# EAGLE design RH039.2 (EAGLE 7.1.0)
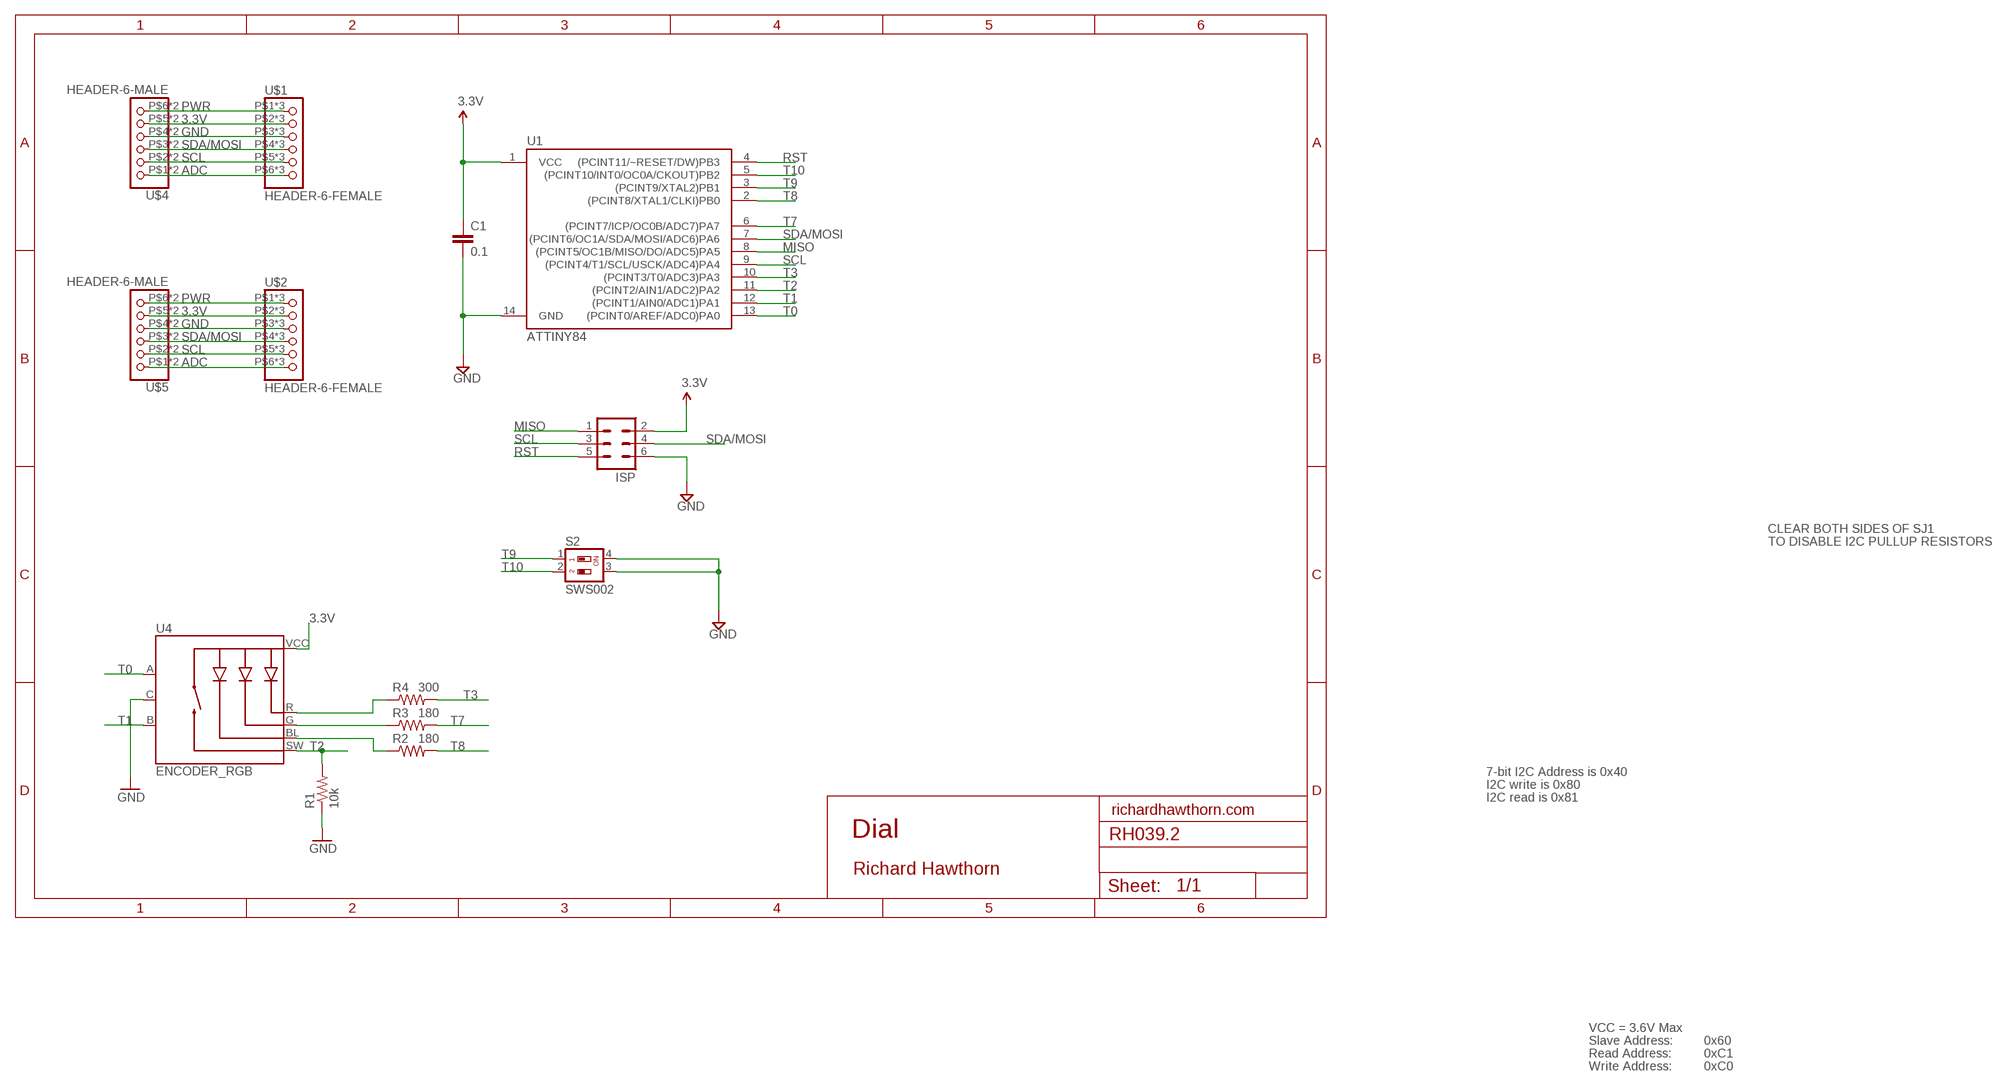
[diagram p0: schematic, sheet 1]

## Parts
C1  0.1  CAP0603-CAP  [0603-CAP]
ISP  MA03-2  [MA03-2]
R1  10k  RESISTOR0402-RES  [0402-RES]
R2  180  RESISTOR0402-RES  [0402-RES]
R3  180  RESISTOR0402-RES  [0402-RES]
R4  300  RESISTOR0402-RES  [0402-RES]
S2  SWS002  [SMS-002]
U1  ATTINY84  [SO14]
U4  ENCODER_RGB  [ENCODER_LED_RGB]
U$1  HEADER-6-FEMALE  [2MMHEADER6]
U$2  HEADER-6-FEMALE  [2MMHEADER6]
U$4  HEADER-6-MALE  [2MMHEADERPIN6]
U$5  HEADER-6-MALE  [2MMHEADERPIN6]

## Nets
3.3V: C1.1 ISP.2 U1.1(VCC) U4.VCC U$1.P$2 U$1.P$10 U$1.P$18 U$2.P$2 U$2.P$10 U$2.P$18 U$4.P$5 U$4.P$13 U$5.P$5 U$5.P$13
ADC: U$1.P$6 U$1.P$14 U$1.P$22 U$2.P$6 U$2.P$14 U$2.P$22 U$4.P$1 U$4.P$9 U$5.P$1 U$5.P$9
GND [power]: C1.2 ISP.6 R1.1 S2.3 S2.4 U1.14(GND) U4.C U$1.P$3 U$1.P$11 U$1.P$19 U$2.P$3 U$2.P$11 U$2.P$19 U$4.P$4 U$4.P$12 U$5.P$4 U$5.P$12
LED-B: R2.1 U4.BL
LED-G: R3.1 U4.G
LED-R: R4.1 U4.R
MISO: ISP.1 U1.8((PCINT5/OC1B/MISO/DO/ADC5)PA5)
PWR [power]: U$1.P$1 U$1.P$9 U$1.P$17 U$2.P$1 U$2.P$9 U$2.P$17 U$4.P$6 U$4.P$14 U$5.P$6 U$5.P$14
RST: ISP.5 U1.4((PCINT11/~RESET/DW)PB3)
SCL: ISP.3 U1.9((PCINT4/T1/SCL/USCK/ADC4)PA4) U$1.P$5 U$1.P$13 U$1.P$21 U$2.P$5 U$2.P$13 U$2.P$21 U$4.P$2 U$4.P$10 U$5.P$2 U$5.P$10
SDA/MOSI: ISP.4 U1.7((PCINT6/OC1A/SDA/MOSI/ADC6)PA6) U$1.P$4 U$1.P$12 U$1.P$20 U$2.P$4 U$2.P$12 U$2.P$20 U$4.P$3 U$4.P$11 U$5.P$3 U$5.P$11
T0: U1.13((PCINT0/AREF/ADC0)PA0) U4.A
T1: U1.12((PCINT1/AIN0/ADC1)PA1) U4.B
T2: R1.2 U1.11((PCINT2/AIN1/ADC2)PA2) U4.SW
T3: R4.2 U1.10((PCINT3/T0/ADC3)PA3)
T7: R3.2 U1.6((PCINT7/ICP/OC0B/ADC7)PA7)
T8: R2.2 U1.2((PCINT8/XTAL1/CLKI)PB0)
T9: S2.1 U1.3((PCINT9/XTAL2)PB1)
T10: S2.2 U1.5((PCINT10/INT0/OC0A/CKOUT)PB2)

## Notes on the sheet
- CLEAR BOTH SIDES OF SJ1
- TO DISABLE I2C PULLUP RESISTORS
- 7-bit I2C Address is 0x40
- I2C write is 0x80
- I2C read is 0x81
- richardhawthorn.com
- Dial
- Richard Hawthorn
- VCC = 3.6V Max
- Slave Address: | 0x60
- Read Address: | 0xC1
- Write Address: | 0xC0

## Library data of the parts
C1 = LowPowerLab:CAP: Capacitor Standard 0603 ceramic capacitor, and 0.1" leaded capacitor.
ISP = Richards:MA03-2: PIN HEADER; OC_FARNELL: unknown; OC_NEWARK: unknown
R1-R4 = SparkFun:RESISTOR: Resistor Basic schematic elements and footprints for 0603, 1206, and PTH resistors.
S2 = smd-special:SWS002: SMD Dip Switch 2 pol.
U1 = SparkFun-DigitalIC:ATTINY84: Atmel 14-pin 2/4/8kB flash uC
U4 = SparkFun:ENCODER_RGB: Illuminated Rotary Encoder w/ RGB LED and select switch EC12PLRGBSDVBF-D: http://top-up.so-buy.com/front/bin/ptdetail.phtml?Part=EC12PLRGBSDVBF-D
U$1 U$2 = Richards:HEADER-6-FEMALE
U$4 U$5 = Richards:HEADER-6-MALE

## Net classes
1 power: width 0.381 mm, clearance 0.254 mm

## Board
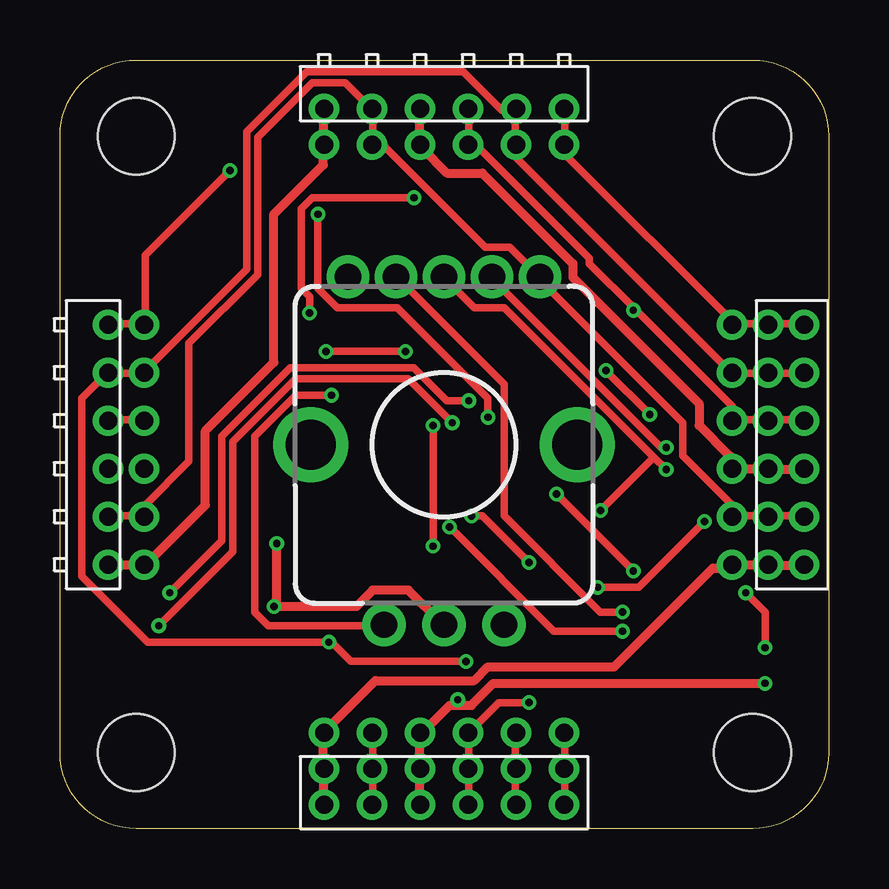
[diagram p1: board, top side]
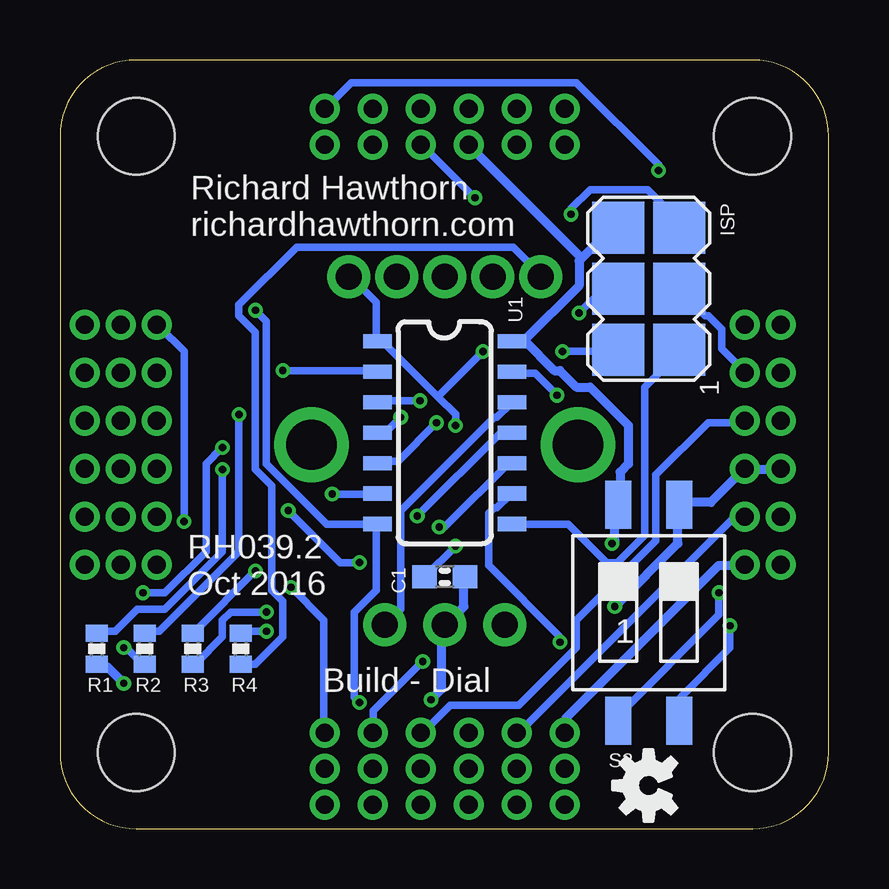
[diagram p2: board, bottom side, seen from below]

Size 32.03 x 32.03 mm. Coordinates in mm from the lower left corner, seen from the top.
Outline: 0,3.17 0,28.86 arc-90 3.17,32.03 28.86,32.03 arc-90 32.03,28.86 32.03,3.17 arc-90 28.86,0 3.17,0 arc-90 0,3.17
Copper layers (1*16): Top 0.035mm / dielectric 1.5mm / Bottom 0.035mm
Design rules "ITEADstudio_DRC *": minimum track width 12mil, minimum drill 12mil, track to track 6mil, track to pad 6mil, pad to pad 6mil, via to via 6mil, smd to smd 0mil, copper to edge 10mil, drill to drill 10mil, minimum pad ring 10mil, minimum via ring 6mil, stop-mask expansion 2mil, vias tented up to drill 100mil, thermal gap 15mil
Holes 3.2 mm at 3.17,3.17 28.86,3.17 3.17,28.86 28.86,28.86
tRestrict: area 0,0 to 5.7,5.7; area 26.3,0 to 32,5.7; area 26.3,26.3 to 32,32; area 0,26.3 to 5.7,32
bRestrict: area 0,26.3 to 5.7,32; area 26.3,26.3 to 32,32; area 26.3,0 to 32,5.7; area 0,0 to 5.7,5.7

### Footprints (pad centres in the part's own frame; a part is rotated, then mirrored left to right if it is on the bottom)
0603-CAP = smd 1.016 x 0.965: 1 -0.85,0; 2 0.85,0
MA03-2 = smd 2.159 x 2.159: 1 -2.54,-1.27; 2 -2.54,1.27; 3 0,-1.27; 4 0,1.27; 5 2.54,-1.27; 6 2.54,1.27
0402-RES = smd 0.7 x 0.9: 1 -0.65,0; 2 0.65,0
SMS-002 = smd 1.092 x 2.007: 1 -1.27,-4.496; 2 1.27,-4.496; 3 1.27,4.496; 4 -1.27,4.496
SO14 = smd 0.6 x 1.2: 1 -3.81,-2.8; 2 -2.54,-2.8; 3 -1.27,-2.8; 4 0,-2.8; 5 1.27,-2.8; 6 2.54,-2.8; 7 3.81,-2.8; 8 3.81,2.8; 9 2.54,2.8; 10 1.27,2.8; 11 0,2.8; 12 -1.27,2.8; 13 -2.54,2.8; 14 -3.81,2.8
ENCODER_LED_RGB = drill 1.1 pad 1.8: A -2.5,-7.5; B 2.5,-7.5; C 0,-7.5 | drill 1.1 pad 1.778: BL 2,7; G -2,7; R -4,7; SW 0,7; VCC 4,7 | drill 2.1: P$1 -5.55,0; P$2 5.55,0
2MMHEADER6 = drill 0.75: P$1 1,5; P$2 1,3; P$3 1,1; P$4 1,-1; P$5 1,-3; P$6 1,-5; P$9 -0.5,5; P$10 -0.5,3; P$11 -0.5,1; P$12 -0.5,-1; P$13 -0.5,-3; P$14 -0.5,-5; P$17 -2,5; P$18 -2,3; P$19 -2,1; P$20 -2,-1; P$21 -2,-3; P$22 -2,-5
2MMHEADERPIN6 = drill 0.75: P$1 1,5; P$2 1,3; P$3 1,1; P$4 1,-1; P$5 1,-3; P$6 1,-5; P$9 -0.5,5; P$10 -0.5,3; P$11 -0.5,1; P$12 -0.5,-1; P$13 -0.5,-3; P$14 -0.5,-5

### Placement (x,y rotation side)
C1  16,10.5 0 bottom
ISP  7.5,22.5 90 bottom
R1  30.5,7.5 90 bottom
R2  28.5,7.5 90 bottom
R3  26.5,7.5 90 bottom
R4  24.5,7.5 90 bottom
S2  7.5,9 0 bottom
U1  16,16.5 270 bottom
U4  16,16 0 top
U$1  16,3 90 top
U$2  29,16 180 top
U$3  [OSHW-LOGO-S]  7.5,1.8 90 bottom
U$4  16,29.5 270 top
U$5  2.5,16 0 top

### Tracks (layer width: path | path; a pad name or v marks a point on that pad's centre or on a via)
3.3V  (via drill 0.3)
  Top 0.305: U$5.P$13 2.06,13.03 3.43,13.03 U$5.P$5 3.54,13.14 3.54,13.49 5.37,15.32 5.37,20.23 8.23,23.09 8.23,28.8 10.52,31.09 11.89,31.09 12.92,30.06 U$4.P$13 13.03,29.95 13.03,28.57 U$4.P$5 13.14,28.46 13.49,28.46 17.72,24.23 18.75,24.23 19.89,23.09 U4.VCC 20,22.86 25.95,16.92 25.95,15.54 28,13.49 28,13.14 U$2.P$2 28,13.03 29.49,13.03 U$2.P$10 29.6,13.03 30.98,13.03 U$2.P$18 | U$1.P$18 13.03,1.03 13.03,2.4 U$1.P$10 13.03,2.63 13.03,3.89 U$1.P$2 | v15.54,16.8 v15.54,11.77 | v14.4,19.89 v11.09,19.89
  Bottom 0.305: U$5.P$5 3.54,12.92 4,12.92 12.92,4 U$1.P$2 | v15.54,11.77 16.8,10.52 C1.1 | v15.54,16.8 15.54,17.26 16.29,18 | 16.29,18 18.52,20.23 18.75,20.23 U1.1 18.86,20.34 18.86,21.95 19.89,22.97 U4.VCC | v11.09,19.89 8.8,19.89 ISP.2 | 16.29,18 v14.4,19.89
ADC  (via drill 0.3)
  Top 0.305: U$5.P$9 2.06,21.03 3.43,21.03 U$5.P$1 3.54,21.14 3.54,23.89 v7.09,27.43 | U$4.P$9 21.03,29.95 21.03,28.57 U$4.P$1 21.14,28.46 21.14,28 28,21.14 U$2.P$6 28,21.03 29.49,21.03 U$2.P$14 29.6,21.03 30.98,21.03 U$2.P$22 | U$1.P$22 21.03,1.03 21.03,2.4 U$1.P$14 21.03,2.63 21.03,3.89 U$1.P$6 | v22.4,10.06 24.12,10.06 v26.86,12.8
  Bottom 0.305: v7.09,27.43 7.09,27.66 10.52,31.09 19.89,31.09 20.92,30.06 U$4.P$9 | v22.4,10.06 21.03,8.69 21.03,4 U$1.P$6 | v26.86,12.8 26.86,19.89 27.89,20.92 U$2.P$6
GND  (via drill 0.3)
  Top 0.381: U$2.P$19 30.98,14.97 29.6,14.97 U$2.P$11 29.49,14.97 28,14.97 U$2.P$3 27.89,15.09 27.89,15.54 26.63,16.8 26.63,17.72 21.37,22.97 21.37,23.55 17.6,27.32 16.12,27.32 15.09,28.35 U$4.P$4 14.97,28.57 14.97,29.95 U$4.P$12 | U$1.P$19 14.97,1.03 14.97,2.4 U$1.P$11 14.97,2.63 14.97,3.89 U$1.P$3 15.09,4 16.23,5.14 16.57,5.14 | v29.38,6.06 18.06,6.06 17.14,5.14 16.57,5.14 | v16.57,5.37 16.57,5.14 | U4.C 15.89,8.57 14.52,9.94 13.03,9.94 12.34,9.26 v8.91,9.26 9.03,9.37 v9.03,11.89
  Bottom 0.381: 12.69,20.34 13.14,20.34 U1.14 | 12.69,20.34 10.4,22.63 10.4,23.66 10.29,23.77 | 10.29,23.77 9.03,25.03 8.8,25.03 ISP.6 | 12.69,20.34 11.43,19.09 11.2,19.09 10.52,18.4 9.94,18.4 8.34,16.8 8.34,15.2 8.69,14.86 8.69,13.6 S2.4 8.91,13.37 8.91,12 v9.03,11.89 | 10.29,23.77 14.97,28.46 U$4.P$4 | U$5.P$12 2.06,14.97 3.31,14.97 U$5.P$4 3.54,14.97 4.92,13.6 6.17,13.6 S2.3 6.29,13.37 6.29,11.89 v8.91,9.26 | C1.2 15.2,10.4 15.2,9.26 15.89,8.57 U4.C 16.12,8.34 16.12,5.83 v16.57,5.37 | v29.38,6.06 30.06,6.74 30.4,6.74 R1.1
LED-B  (via drill 0.3)
  Top 0.305: v29.38,7.54 29.38,9.03 v28.57,9.83 | v25.26,15.89 25.03,15.89 17.95,22.97 U4.BL
  Bottom 0.305: v29.38,7.54 29.26,7.54 28.57,6.86 R2.1 | v28.57,9.83 27.66,9.83 25.95,11.54 25.95,15.2 v25.26,15.89
LED-G  (via drill 0.3)
  Top 0.305: v23.43,9.03 22.52,9.03 18.52,13.03 18.52,18.52 14.06,22.97 U4.G
  Bottom 0.305: v23.43,9.03 24.92,9.03 25.26,8.69 25.26,8 26.4,6.86 R3.1
LED-R
  Bottom 0.305: R4.1 24.46,6.86 23.89,6.86 22.75,8 22.75,9.49 23.2,9.94 23.2,14.29 23.89,14.97 23.89,20.69 24.57,21.37 24.57,21.83 22.17,24.23 13.14,24.23 12,23.09 U4.R
MISO
  Bottom 0.305: U1.8 13.14,12.69 10.86,12.69 9.26,11.09 8.8,11.09 7.66,12.23 7.66,18.4 6.17,19.89 ISP.1
PWR
  Top 0.381: U$2.P$17 30.98,10.97 29.6,10.97 U$2.P$9 29.49,10.97 28,10.97 U$2.P$1 27.89,10.86 27.2,10.86 23.09,6.74 17.83,6.74 17.26,6.17 13.14,6.17 11.09,4.12 U$1.P$1 10.97,3.89 10.97,2.63 U$1.P$9 10.97,2.4 10.97,1.03 U$1.P$17 | U$4.P$14 10.97,29.95 10.97,28.57 U$4.P$6 10.97,28.35 10.97,27.66 8.91,25.6 8.91,19.43 6.06,16.57 6.06,13.49 3.66,11.09 U$5.P$6 3.43,10.97 2.06,10.97 U$5.P$14
  Bottom 0.381: U$5.P$6 3.54,10.97 4.57,10.97 10.97,4.57 10.97,4 U$1.P$1
RST  (via drill 0.3)
  Top 0.305: v17.83,17.14 17.83,17.95 14.06,21.72 11.54,21.72 10.74,22.52 v10.74,25.6
  Bottom 0.305: v17.83,17.14 18.4,16.57 18.75,16.57 U1.4 | v10.74,25.6 10.74,25.83 9.94,26.63 7.54,26.63 6.29,25.38 6.29,25.15 ISP.5
SCL  (via drill 0.3)
  Top 0.305: U$2.P$21 30.98,18.97 29.6,18.97 U$2.P$13 29.49,18.97 28,18.97 U$2.P$5 27.89,19.09 18.97,28 18.97,28.35 U$4.P$2 18.97,28.57 18.97,29.95 U$4.P$10 18.86,29.95 18.4,29.95 16.8,31.55 10.29,31.55 7.77,29.03 7.77,23.32 3.54,19.09 U$5.P$2 3.43,18.97 2.06,18.97 U$5.P$10 1.94,18.97 0.91,17.95 0.91,10.52 3.66,7.77 v11.2,7.77 11.32,7.77 12.12,6.97 v16.92,6.97 | U$1.P$21 18.97,1.03 18.97,2.4 U$1.P$13 18.97,2.63 18.97,3.89 U$1.P$5
  Bottom 0.305: ISP.3 6.17,22.4 5.14,21.37 5.03,21.37 4.46,20.8 4.46,20 3.54,19.09 U$5.P$2 | v11.2,7.77 11.2,8 14.17,10.97 14.17,13.14 13.95,13.37 13.83,13.37 13.26,13.95 U1.9 | v16.92,6.97 18.97,4.92 18.97,4 U$1.P$5
SDA/MOSI  (via drill 0.3)
  Top 0.305: U$5.P$11 2.06,17.03 3.43,17.03 U$5.P$3 | U$1.P$20 17.03,1.03 17.03,2.4 U$1.P$12 17.03,2.63 17.03,3.89 U$1.P$4 17.03,4 18.29,5.26 v19.55,5.26 | U$2.P$20 30.98,17.03 29.6,17.03 U$2.P$12 29.49,17.03 28,17.03 U$2.P$4 28,17.14 28,17.6 23.95,21.66 | v10.4,21.49 10.4,22.17 10.06,22.52 10.06,25.83 10.52,26.29 v14.74,26.29 | U$4.P$11 17.03,29.95 17.03,28.57 U$4.P$3 17.14,28.69 22.06,23.77 22.06,23.55 23.95,21.66 | v23.89,21.6 23.95,21.66
  Bottom 0.305: v19.55,5.26 19.77,5.49 19.77,9.03 18.86,9.94 18.86,12.69 U1.7 18.97,12.69 20.92,12.69 23.43,15.2 23.43,21.14 v23.89,21.6 | U$5.P$3 3.54,16.92 5.03,16.92 7.2,14.74 7.2,12 10.52,8.69 10.52,7.54 12.92,5.14 15.77,5.14 16.92,4 U$1.P$4 | v10.4,21.49 9.49,22.4 8.8,22.4 ISP.4 | v14.74,26.29 16.92,28.46 U$4.P$3
T0  (via drill 0.3)
  Top 0.305: v11.32,18.06 9.83,18.06 8.12,16.34 8.12,9.03 8.69,8.46 13.49,8.46 U4.A
  Bottom 0.305: v11.32,18.06 12.23,18.97 13.14,18.97 U1.13
T1
  Bottom 0.305: U1.12 13.26,17.72 13.83,17.14 13.95,17.14 17.83,13.26 17.83,9.14 18.4,8.57 U4.B
T2  (via drill 0.3)
  Top 0.305: 24.75,15.49 18.52,21.72 17.26,21.72 16,22.97 U4.SW | 24.75,15.49 v25.26,14.97 | v17.14,13.03 17.6,13.03 v19.55,11.09 | 24.75,15.49 v22.52,13.26
  Bottom 0.305: v25.26,14.97 25.26,11.54 27.66,9.14 28.8,9.14 29.72,8.23 30.4,8.23 R1.2 | v17.14,13.03 13.72,16.46 13.26,16.46 U1.11 | v19.55,11.09 20.34,11.09 v22.52,13.26
T3  (via drill 0.3)
  Top 0.305: v23.43,8.23 20.57,8.23 v16.23,12.57
  Bottom 0.305: v23.43,8.23 24.46,8.23 R4.2 | v16.23,12.57 16,12.57 13.26,15.32 U1.10
T7  (via drill 0.3)
  Top 0.305: v20.69,13.95 v23.89,10.74
  Bottom 0.305: v23.89,10.74 26.4,8.23 R3.2 | v20.69,13.95 18.86,13.95 U1.6
T8  (via drill 0.3)
  Top 0.305: v22.75,19.09 v24.57,17.26
  Bottom 0.305: v24.57,17.26 24.57,11.54 27.89,8.23 28.46,8.23 R2.2 | v22.75,19.09 18.86,19.09 U1.2
T9  (via drill 0.3)
  Top 0.305: v17.03,17.83 16.12,17.83 14.74,19.2 9.6,19.2 6.74,16.34 6.74,12 v4.57,9.83
  Bottom 0.305: v17.03,17.83 18.75,17.83 U1.3 | v4.57,9.83 4.57,8.91 8.69,4.8 8.69,4.57 S2.1
T10  (via drill 0.3)
  Top 0.305: v16.34,16.92 14.52,18.75 9.83,18.75 7.2,16.12 7.2,11.54 v4.12,8.46
  Bottom 0.305: v16.34,16.92 17.95,15.32 18.75,15.32 U1.5 | v4.12,8.46 4.12,7.54 6.17,5.49 6.17,4.57 S2.2

### Text on the board
bPlace: Richard Hawthorn / richardhawthorn.com | RH039.2 / Oct 2016 | Build - Dial
tDocu: REG